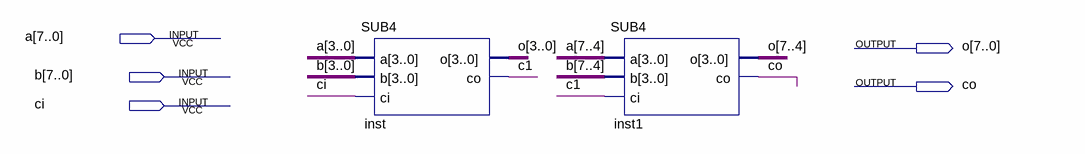
[diagram p0: schematic sheet]
// Quartus schematic SUB8.bdf as structural Verilog: 2 symbols, 5 pins
module SUB8 (
  input  [7:0] a,
  input  [7:0] b,
  input  ci,
  output [7:0] o,
  output co
);

  wire c1;

  SUB4 inst (.a(a[3:0]), .b(b[3:0]), .ci(ci), .o(o[3:0]), .co(c1));
  SUB4 inst1 (.a(a[7:4]), .b(b[7:4]), .ci(c1), .o(o[7:4]), .co(co));
endmodule
